# EAGLE design Fuse (EAGLE 6.5.0)
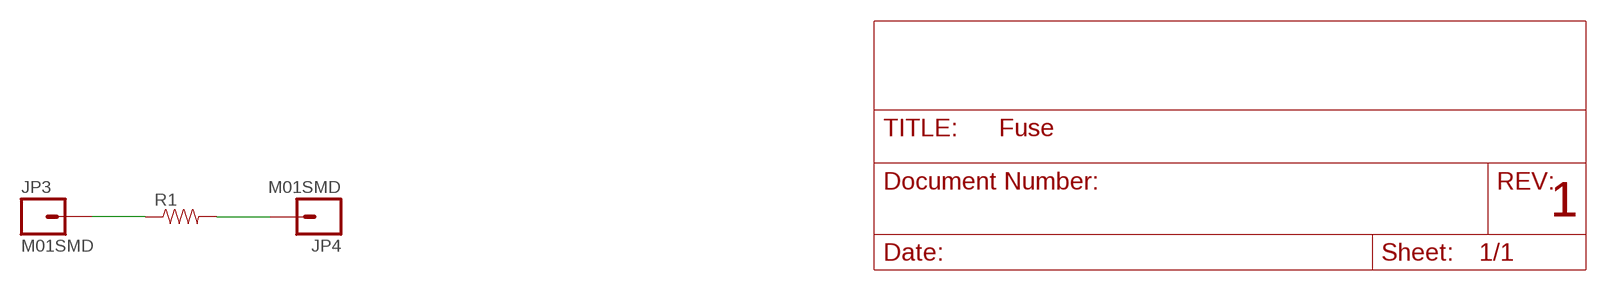
[diagram p0: schematic, sheet 1]

## Parts
JP3  M01SMD  [LUXEON-PAD]
JP4  M01SMD  [LUXEON-PAD]
R1  RESISTOR1206  [1206]

## Nets
N$3: JP3.P$1 R1.1
N$4: JP4.P$1 R1.2

## Notes on the sheet
- 1

## Library data of the parts
JP3 JP4 = SparkFun-Connectors:M01: Header 1 Standard 1-pin 0.1" header. Use with straight break away headers (SKU : PRT-00116), right angle break away headers (PRT-00553), swiss pins (PRT-00743), machine pins (PRT-00117), and female headers (PRT-00115).
R1 = SparkFun-Passives:RESISTOR: Resistor Basic schematic elements and footprints for 0603, 1206, and PTH resistors.

## Board
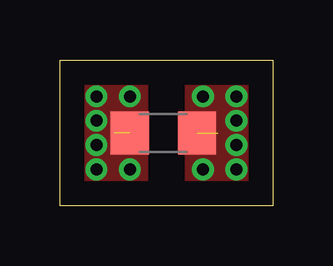
[diagram p1: board, top side]
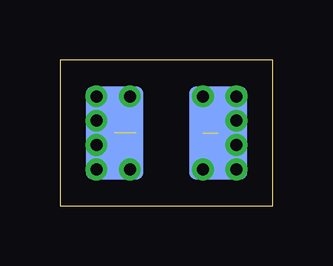
[diagram p2: board, bottom side, seen from below]

Size 8.89 x 6.1 mm. Coordinates in mm from the lower left corner, seen from the top.
Outline: 0,6.1 8.89,6.1 8.89,0 0,0 0,6.1
Copper layers (1*16): Top 0.035mm / dielectric 1.5mm / Bottom 0.035mm
Design rules "default": minimum track width 10mil, minimum drill 24mil, track to track 8mil, track to pad 8mil, pad to pad 8mil, via to via 8mil, smd to smd 8mil, copper to edge 40mil, drill to drill 8mil, minimum pad ring 10mil, minimum via ring 8mil, stop-mask expansion 4mil, vias tented up to drill 0mil, thermal gap 10mil

### Footprints (pad centres in the part's own frame; a part is rotated, then mirrored left to right if it is on the bottom)
LUXEON-PAD = smd 3.9 x 2.4: P$1 0,0
1206 = smd 1.6 x 1.8: 1 -1.4,0; 2 1.4,0

### Placement (x,y rotation side)
JP3  2.29,3.05 90 bottom
JP4  6.6,3.05 270 bottom
R1  4.32,3.05 0 top

### Tracks (layer width: path | path; a pad name or v marks a point on that pad's centre or on a via)
N$3  (via drill 0.5)  (1 unrouted)
  other vias: 1.52,4.57 1.52,3.56 1.52,2.54 1.52,1.52 2.92,1.52 2.92,4.57
  pour Top (no thermals): 1.02,5.08 3.56,5.08 3.56,1.02 1.02,1.02
N$4  (via drill 0.5)  (1 unrouted)
  other vias: 7.37,4.57 7.37,3.56 7.37,2.54 7.37,1.52 5.97,1.52 5.97,4.57
  pour Top (no thermals): 5.33,5.08 7.87,5.08 7.87,1.02 5.33,1.02